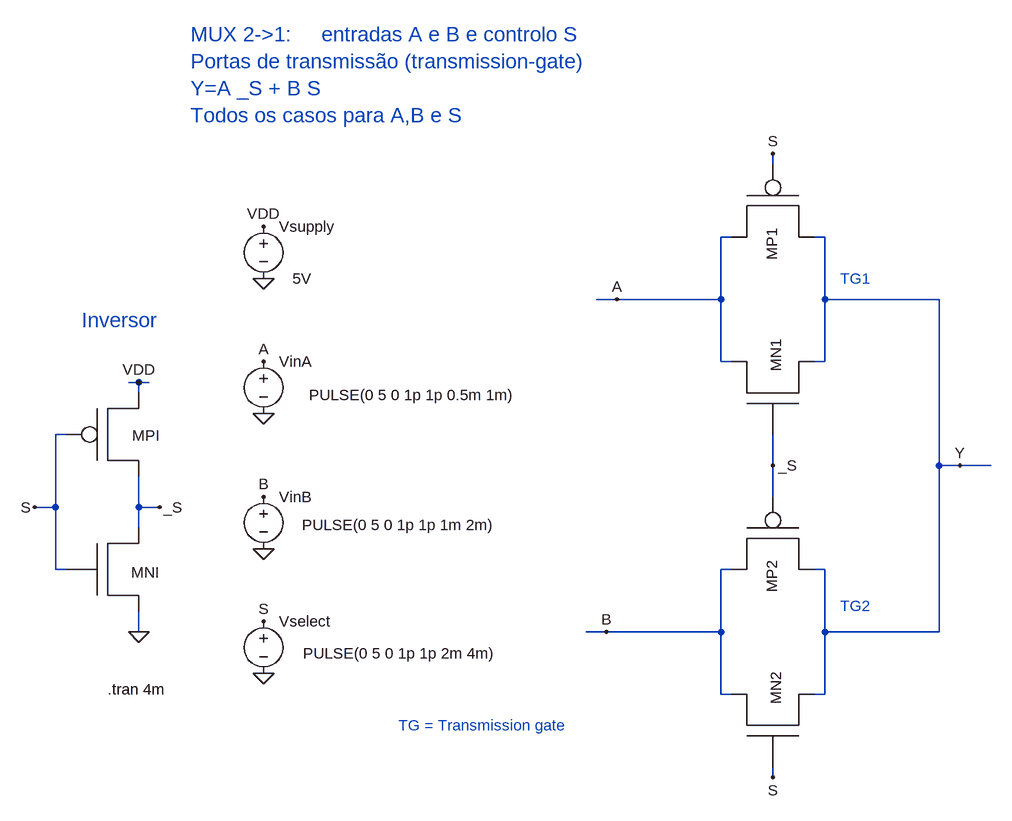
[diagram p0: schematic MUX-TG-21.asc]
MUX-TG-21.asc, the LTspice schematic file:
Version 4
SHEET 1 1468 680
WIRE 336 -640 336 -656
WIRE 272 -528 256 -528
WIRE 416 -528 400 -528
WIRE 96 -432 64 -432
WIRE 256 -432 256 -528
WIRE 256 -432 96 -432
WIRE 416 -432 416 -528
WIRE 592 -432 416 -432
WIRE 256 -336 256 -432
WIRE 272 -336 256 -336
WIRE 416 -336 416 -432
WIRE 416 -336 400 -336
WIRE -640 -304 -656 -304
WIRE -624 -304 -640 -304
WIRE -640 -288 -640 -304
WIRE -752 -224 -768 -224
WIRE 336 -176 336 -224
WIRE 592 -176 592 -432
WIRE 624 -176 592 -176
WIRE 672 -176 624 -176
WIRE 336 -128 336 -176
WIRE -768 -112 -768 -224
WIRE -768 -112 -800 -112
WIRE -640 -112 -640 -160
WIRE -608 -112 -640 -112
WIRE -640 -80 -640 -112
WIRE -768 -16 -768 -112
WIRE -752 -16 -768 -16
WIRE 272 -16 256 -16
WIRE 416 -16 400 -16
WIRE -640 80 -640 48
WIRE 80 80 48 80
WIRE 256 80 256 -16
WIRE 256 80 80 80
WIRE 416 80 416 -16
WIRE 592 80 592 -176
WIRE 592 80 416 80
WIRE 256 176 256 80
WIRE 272 176 256 176
WIRE 416 176 416 80
WIRE 416 176 400 176
WIRE 336 304 336 288
FLAG -448 -544 VDD
FLAG -448 -464 0
FLAG -448 -256 0
FLAG -448 -48 0
FLAG -448 144 0
FLAG -448 -336 A
FLAG -448 -128 B
FLAG -448 64 S
FLAG 96 -432 A
FLAG 80 80 B
FLAG 336 -656 S
FLAG 336 304 S
FLAG 336 -176 _S
FLAG 624 -176 Y
FLAG -640 -304 VDD
FLAG -800 -112 S
FLAG -608 -112 _S
FLAG -640 80 0
SYMBOL voltage -448 -352 R0
WINDOW 3 70 67 Left 2
WINDOW 123 0 0 Left 2
WINDOW 39 0 0 Left 2
SYMATTR Value PULSE(0 5 0 1p 1p 0.5m 1m)
SYMATTR InstName VinA
SYMBOL voltage -448 -144 R0
WINDOW 3 59 59 Left 2
WINDOW 123 0 0 Left 2
WINDOW 39 0 0 Left 2
SYMATTR Value PULSE(0 5 0 1p 1p 1m 2m)
SYMATTR InstName VinB
SYMBOL voltage -448 -560 R0
WINDOW 3 45 96 Left 2
SYMATTR Value 5V
SYMATTR InstName Vsupply
SYMBOL voltage -448 48 R0
WINDOW 3 61 65 Left 2
WINDOW 123 0 0 Left 2
WINDOW 39 0 0 Left 2
SYMATTR Value PULSE(0 5 0 1p 1p 2m 4m)
SYMATTR InstName Vselect
SYMBOL PMOSX 352 -560 R90
SYMATTR InstName MP1
SYMBOL NMOSX 320 -304 R270
SYMATTR InstName MN1
SYMBOL PMOSX 352 -48 R90
SYMATTR InstName MP2
SYMBOL NMOSX 320 208 R270
SYMATTR InstName MN2
SYMBOL PMOSX -672 -240 R0
SYMATTR InstName MPI
SYMBOL NMOSX -672 -32 R0
SYMATTR InstName MNI
TEXT -688 168 Left 2 !.tran 4m
TEXT -560 -840 Left 3 ;MUX 2->1:     entradas A e B e controlo S\nPortas de transmissão (transmission-gate)\nY=A _S + B S\nTodos os casos para A,B e S
TEXT 440 -464 Left 2 ;TG1
TEXT 440 40 Left 2 ;TG2
TEXT -728 -400 Left 3 ;Inversor
TEXT -240 224 Left 2 ;TG = Transmission gate

The netlist it stands for:
* MUX-TG-21.asc
VinA A 0 PULSE(0 5 0 1p 1p 0.5m 1m)
VinB B 0 PULSE(0 5 0 1p 1p 1m 2m)
Vsupply VDD 0 5V
Vselect S 0 PULSE(0 5 0 1p 1p 2m 4m)
XMP1 A S Y PMOSX  ; pins D G S
XMN1 A _S Y NMOSX  ; pins D G S
XMP2 B _S Y PMOSX  ; pins D G S
XMN2 B S Y NMOSX  ; pins D G S
XMPI _S S VDD PMOSX  ; pins D G S
XMNI _S S 0 NMOSX  ; pins D G S
.tran 4m
* MUX 2->1:     entradas A e B e controlo S
* Portas de transmissão (transmission-gate)
* Y=A _S + B S
* Todos os casos para A,B e S
* TG1
* TG2
* Inversor
* TG = Transmission gate
.lib MOS4007.txt
.backanno
.end